# EAGLE design Transistor Tester - Ard MiniPro - v2 (EAGLE 6.5.0)
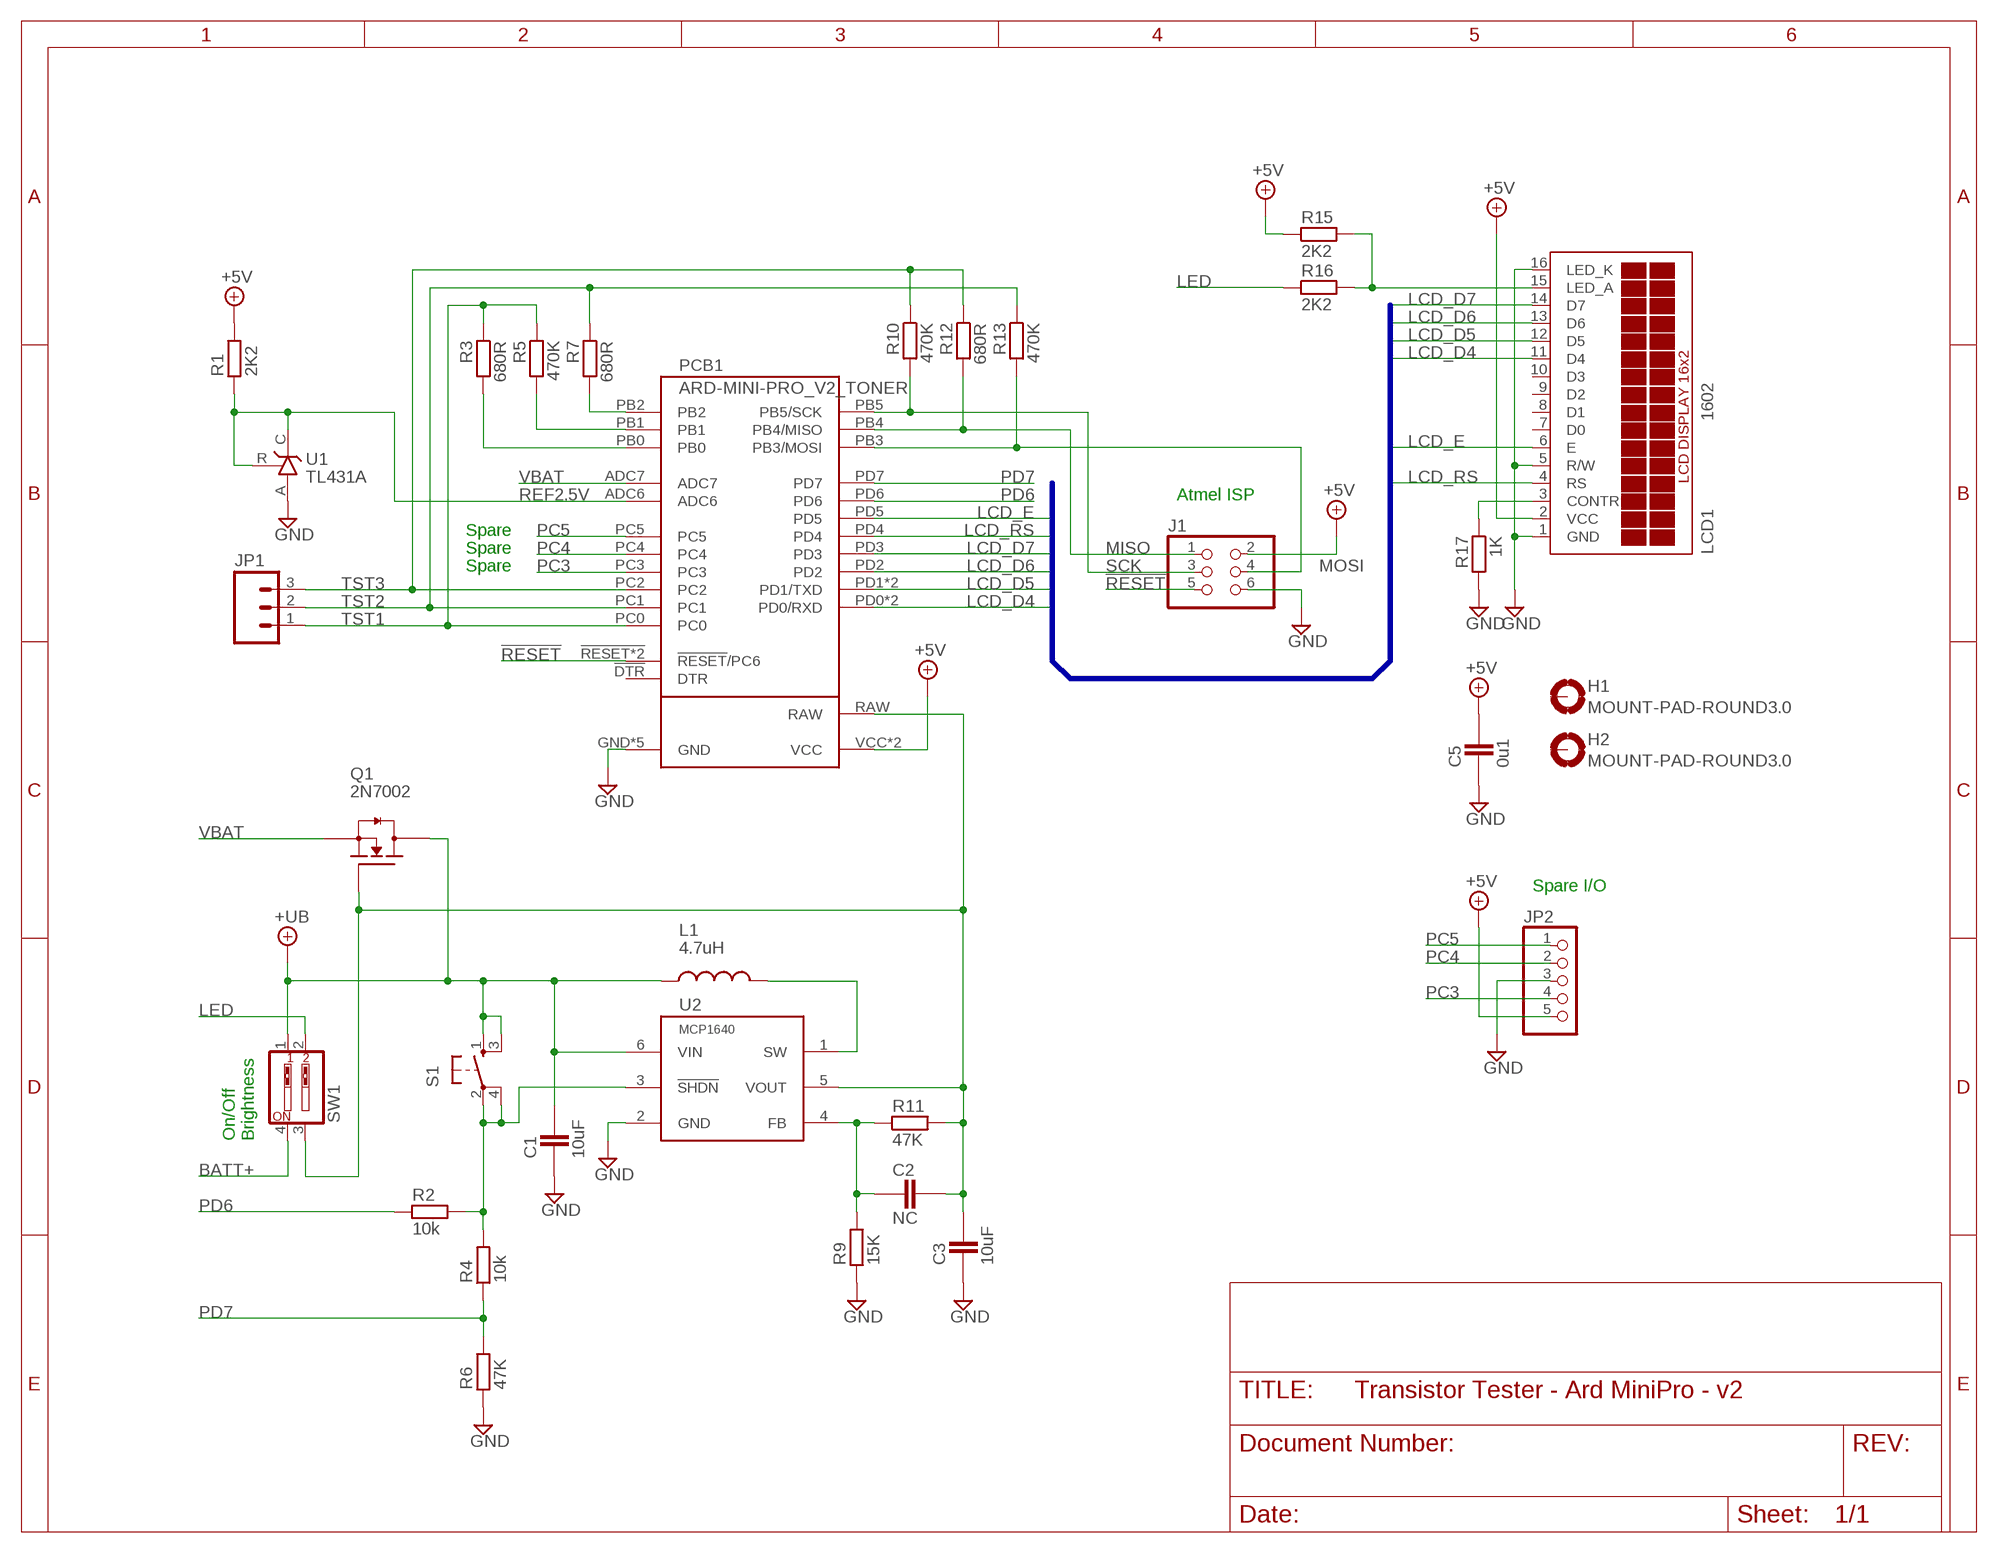
[diagram p0: schematic, sheet 1]

## Parts
C1  10uF  CAPACITOR_0805  [CAPC2012X145AN]
C2  NC  CAPACITOR_0805  [CAPC2012X145AN]
C3  10uF  CAPACITOR_0805  [CAPC2012X145AN]
C5  0u1  CAPACITOR_0603  [CAPC1608X92N]
H1  MOUNT-PAD-ROUND3.0  [3,0-PAD]
H2  MOUNT-PAD-ROUND3.0  [3,0-PAD]
J1  PINHD-2X3_2.54  [2X03]
JP1  M03POLAR  [MOLEX-1X3]
JP2  PINHD-1X5  [1X05]
L1  4.7uH  CD43  [CD43]
LCD1  1602  TUXGR_16X2_R2NOMOUNT  [TUXGR_16X2_R2_NM]
PCB1  ARD-MINI-PRO_V2_TONER  [ARDUINO-PRO-MINI_V2_TONER]
Q1  2N7002  MOSFET-NCH_SOT-23  [SOT95P280X135-3N]
R1  2K2  RESISTOR_0603  [RESC1608X55N]
R2  10k  RESISTOR_0603  [RESC1608X55N]
R3  680R  RESISTOR_0603  [RESC1608X55N]
R4  10k  RESISTOR_0603  [RESC1608X55N]
R5  470K  RESISTOR_0603  [RESC1608X55N]
R6  47K  RESISTOR_0603  [RESC1608X55N]
R7  680R  RESISTOR_0603  [RESC1608X55N]
R9  15K  RESISTOR_0603  [RESC1608X55N]
R10  470K  RESISTOR_0603  [RESC1608X55N]
R11  47K  RESISTOR_0603  [RESC1608X55N]
R12  680R  RESISTOR_0603  [RESC1608X55N]
R13  470K  RESISTOR_0603  [RESC1608X55N]
R15  2K2  RESISTOR_0603  [RESC1608X55N]
R16  2K2  RESISTOR_0603  [RESC1608X55N]
R17  1K  RESISTOR_0603  [RESC1608X55N]
S1  MOM_SWTH  [MOM_SW]
SW1  SW_DIP-2  [EDG-02]
U1  TL431A  TL_431LP  [TO92-CLP]
U2  MCP1640  BOOST-MCP1624T-I/CHY  [SOT26]

## Nets
!RESET: J1.5 PCB1.!RESET(!RESET!/PC6) PCB1.!RESET@3(!RESET!/PC6)
!SHUTDN: R2.2 R4.2 S1.2 S1.4 U2.3(!SHDN)
+5V: C5.2 J1.2 JP2.5 LCD1.2(VCC) PCB1.VCC PCB1.VCC@2(VCC) R1.2 R15.1
+UB: C1.2 L1.1 Q1.3(D) S1.1 S1.3 SW1.1 U2.6(VIN)
BATT+: SW1.4
GND: C1.1 C3.1 C5.1 J1.6 JP2.3 LCD1.1(GND) LCD1.5(R/W) LCD1.16(LED_K) PCB1.GND PCB1.GND@1(GND) PCB1.GND@2(GND) PCB1.GND@3(GND) PCB1.GND@5(GND) R6.1 R9.1 R17.2 U1.A U2.2(GND)
LCD_A: LCD1.15(LED_A) R15.2 R16.2
LCD_D4: LCD1.11(D4) PCB1.PD0(PD0/RXD) PCB1.PD0@2(PD0/RXD)
LCD_D5: LCD1.12(D5) PCB1.PD1(PD1/TXD) PCB1.PD1@2(PD1/TXD)
LCD_D6: LCD1.13(D6) PCB1.PD2
LCD_D7: LCD1.14(D7) PCB1.PD3
LCD_E: LCD1.6(E) PCB1.PD5
LCD_RS: LCD1.4(RS) PCB1.PD4
LED: R16.1 SW1.2
MISO: J1.1 PCB1.PB4(PB4/MISO) R12.2
MOSI: J1.4 PCB1.PB3(PB3/MOSI) R13.2
N$2: L1.2 U2.1(SW)
N$3: C2.2 C3.2 PCB1.RAW Q1.1(G) R11.2 SW1.3 U2.5(VOUT)
N$4: PCB1.PB0 R3.2
N$5: PCB1.PB1 R5.2
N$6: PCB1.PB2 R7.2
N$7: C2.1 R9.2 R11.1 U2.4(FB)
N$27: LCD1.3(CONTR) R17.1
PC3: JP2.4 PCB1.PC3
PC4: JP2.2 PCB1.PC4
PC5: JP2.1 PCB1.PC5
PD6: PCB1.PD6 R2.1
PD7: PCB1.PD7 R4.1 R6.2
REF2.5V: PCB1.ADC6 R1.1 U1.C U1.R
SCK: J1.3 PCB1.PB5(PB5/SCK) R10.2
TST1: JP1.1 PCB1.PC0 R3.1 R5.1
TST2: JP1.2 PCB1.PC1 R7.1 R13.1
TST3: JP1.3 PCB1.PC2 R10.1 R12.1
VBAT: PCB1.ADC7 Q1.2(S)
Unconnected: H1.B3,0(MOUNT) H2.B3,0(MOUNT) LCD1.7(D0) LCD1.8(D1) LCD1.9(D2) LCD1.10(D3) PCB1.!DTR(DTR)

## Buses
B$1

## Notes on the sheet
- Atmel ISP
- Spare
- Spare
- Spare
- Spare I/O
- On/Off
  Brightness

## Library data of the parts
C1-C3 C5 = ipc-7351-capacitor:CAPACITOR_
H1 H2 = holes:MOUNT-PAD-ROUND: MOUNTING PAD, round
J1 = Misc Conn:PINHD-2X3: PIN HEADER
JP1 = SparkFun-Connectors:M03: Header 3 Standard 3-pin 0.1" header. Use with straight break away headers (SKU : PRT-00116), right angle break away headers (PRT-00553), swiss pins (PRT-00743), machine pins (PRT-00117), and female headers (PRT-00115). Molex polarized connector foot print use with SKU : PRT-08232 with associated crimp pins and housings.
JP2 = pinhead:PINHD-1X5: PIN HEADER
L1 = Misc Inductors:CD
LCD1 = Misc opto:TUXGR_16X2_R2: Tuxgraphics LCD display 16x2 characters reflective, without background light Source: tuxgr_12x2_r2.pdf; OC_FARNELL: unknown; OC_NEWARK: unknown
PCB1 = misc pcb:ARD-MINI-PRO
Q1 = ipc-7351-transistor:MOSFET-NCH_
R1-R7 R9-R13 R15-R17 = ipc-7351-resistor:RESISTOR_
S1 = Misc Passives:MOM_SW: Tact Switch
SW1 = special:SW_DIP-2: DIP SWITCH
U1 = Misc Analog:TL_431: Voltage Reference 1.24V TI TL431, ST3431
U2 = Misc Power:BOOST-

## Net classes
1 diff: width 0.003 mm, drill 0.006 mm, clearance 0.007 mm

## Board
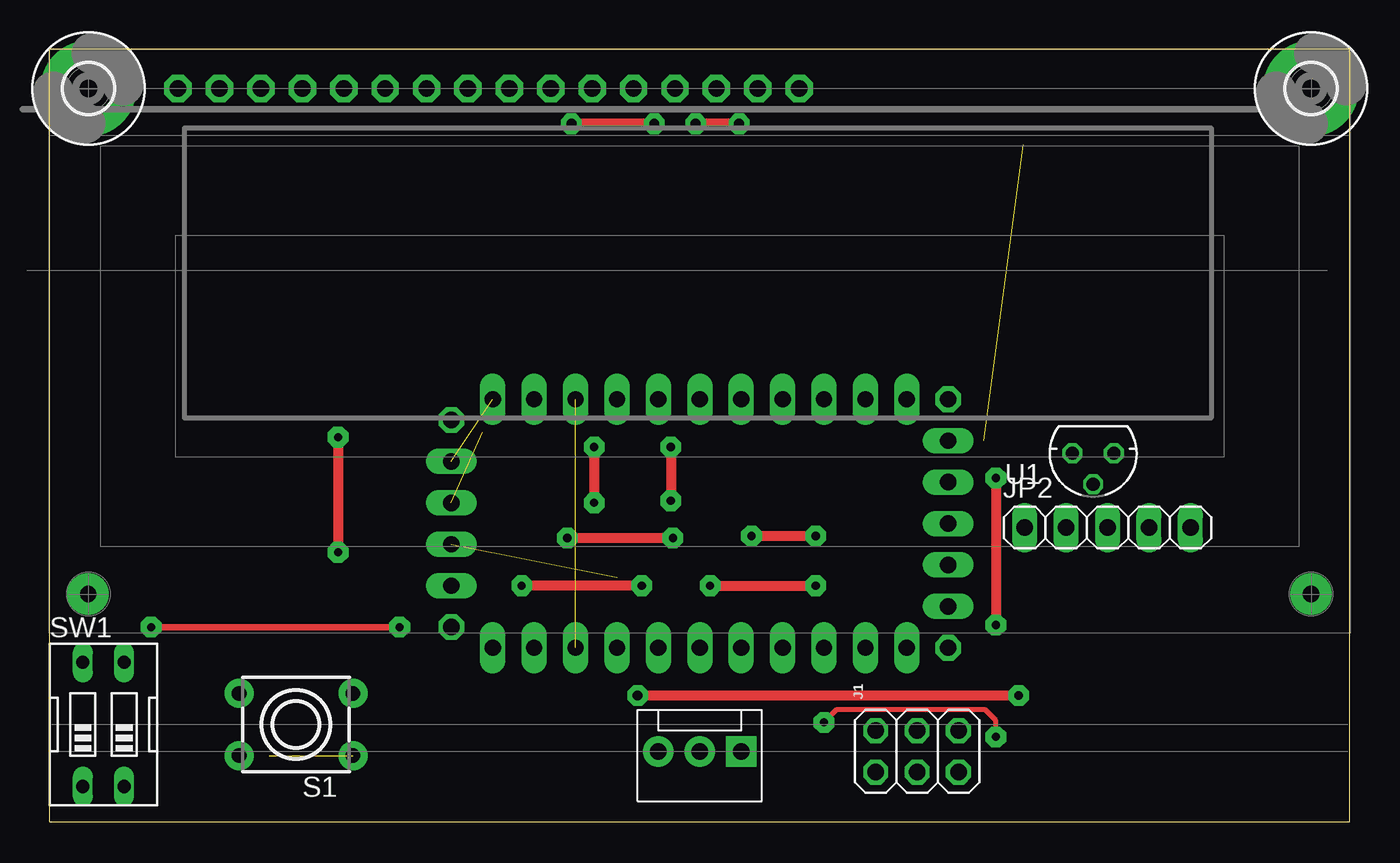
[diagram p1: board, top side]
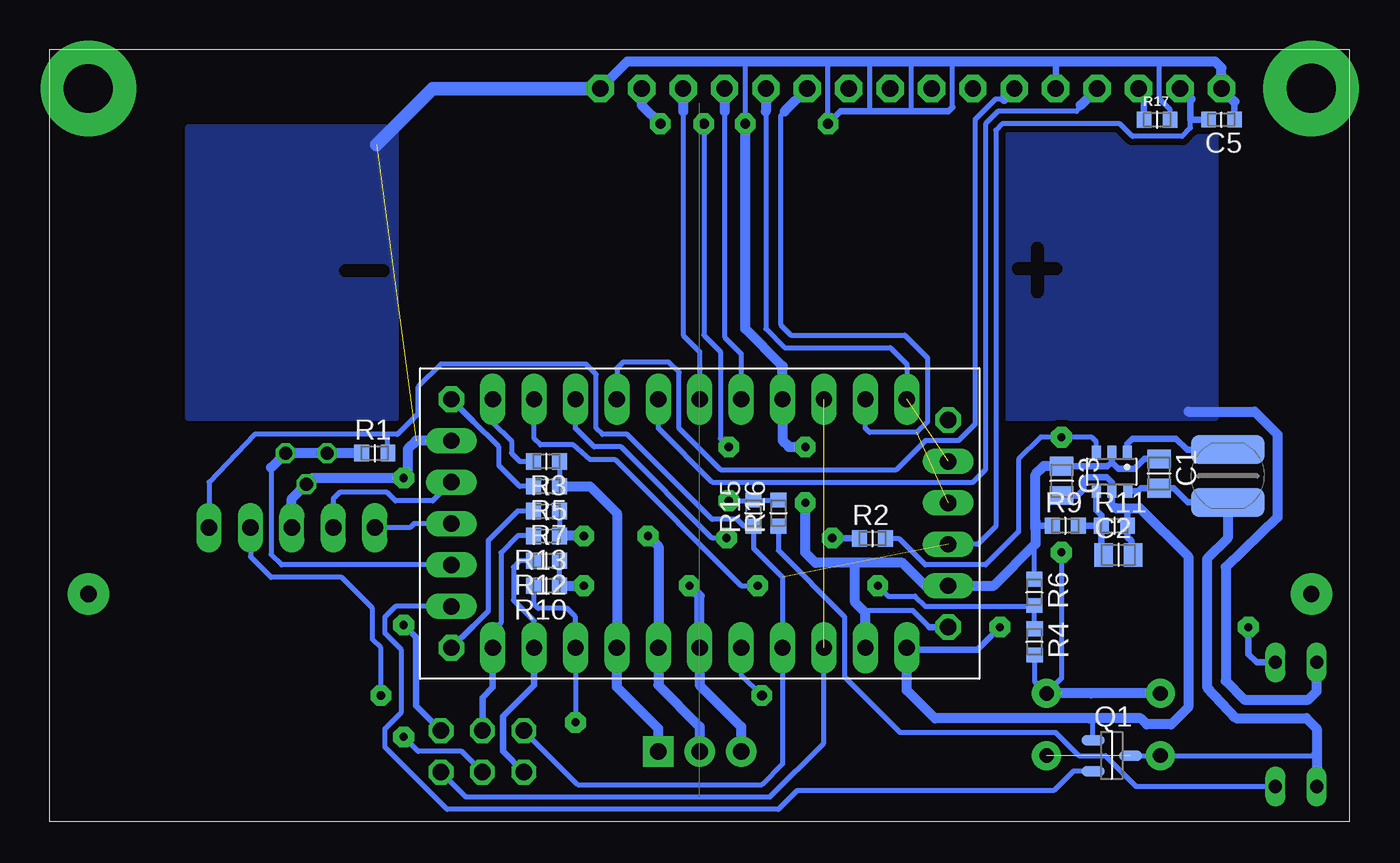
[diagram p2: board, bottom side, seen from below]

Size 79.76 x 47.37 mm. Coordinates in mm from the lower left corner, seen from the top.
Outline: 0,0 79.76,0 79.76,47.37 0,47.37 0,0
Copper layers (1*16): Top 0.035559375mm / dielectric 1.6mm / Bottom 0.035559375mm
Design rules "oshpark-2layer": minimum track width 6mil, minimum drill 10mil, track to track 6mil, track to pad 6mil, pad to pad 6mil, via to via 6mil, smd to smd 6mil, copper to edge 15mil, drill to drill 6mil, minimum pad ring 5mil, minimum via ring 5mil, stop-mask expansion 2.5mil, vias tented up to drill 0mil, thermal gap 10mil
bRestrict: 3 lines

### Footprints (pad centres in the part's own frame; a part is rotated, then mirrored left to right if it is on the bottom)
CAPC2012X145AN = smd 1.15 x 1.45: 1 -0.9,0; 2 0.9,0
CAPC1608X92N = smd 0.9 x 0.95: 1 -0.8,0; 2 0.8,0
3,0-PAD = drill 3 pad 5.842: B3,0 0,0
2X03 = drill 1.016 octagon: 1 -2.54,-1.27; 2 -2.54,1.27; 3 0,-1.27; 4 0,1.27; 5 2.54,-1.27; 6 2.54,1.27
MOLEX-1X3 = drill 1.016 pad 1.88 square: 1 0,0 | drill 1.016 pad 1.88: 2 2.54,0; 3 5.08,0
1X05 = drill 1.016 long: 1 -5.08,0; 2 -2.54,0; 3 0,0; 4 2.54,0; 5 5.08,0
CD43 = smd 4.5 x 1.75: 1 0,1.625; 2 0,-1.625
TUXGR_16X2_R2_NM = drill 1 pad 1.676 octagon: 1 -32,15.5; 2 -29.46,15.5; 3 -26.92,15.5; 4 -24.38,15.5; 5 -21.84,15.5; 6 -19.3,15.5; 7 -16.76,15.5; 8 -14.22,15.5; 9 -11.68,15.5; 10 -9.14,15.5; 11 -6.6,15.5; 12 -4.06,15.5; 13 -1.52,15.5; 14 1.02,15.5; 15 3.56,15.5; 16 6.1,15.5
ARDUINO-PRO-MINI_V2_TONER = drill 1 pad 1.575 octagon: !DTR -15.24,-6.35; GND@1 -15.24,6.35; PB1 15.24,-7.62; PB2 15.24,7.62 | drill 1 pad 1.575 long: !RESET -7.62,-7.62; !RESET@3 -7.62,7.62; ADC6 15.24,2.54; ADC7 15.24,5.08; GND 15.24,-5.08; GND@2 -5.08,-7.62; GND@3 -15.24,3.81; GND@5 -10.16,7.62; PB0 12.7,-7.62; PB3 12.7,7.62; PB4 10.16,7.62; PB5 7.62,7.62; PC0 5.08,7.62; PC1 2.54,7.62; PC2 0,7.62; PC3 -2.54,7.62; PC4 15.24,-2.54; PC5 15.24,0; PD0 -15.24,-1.27; PD0@2 -10.16,-7.62; PD1 -15.24,-3.81; PD1@2 -12.7,-7.62; PD2 -2.54,-7.62; PD3 0,-7.62; PD4 2.54,-7.62; PD5 5.08,-7.62; PD6 7.62,-7.62; PD7 10.16,-7.62; RAW -12.7,7.62; VCC -15.24,1.27; VCC@2 -5.08,7.62
SOT95P280X135-3N = smd 1.4 x 0.65: 1 -1.15,0.95; 2 -1.15,-0.95; 3 1.15,0
RESC1608X55N = smd 0.9 x 1: 1 -0.8,0; 2 0.8,0
MOM_SW = drill 0.9 pad 1.778: 1 -1.905,3.493; 2 1.905,3.493; 3 -1.905,-3.493; 4 1.905,-3.493
EDG-02 = drill 0.813 long: 1 -1.27,-3.81; 2 1.27,-3.81; 3 1.27,3.81; 4 -1.27,3.81
TO92-CLP = drill 0.813 octagon: A 0,1.905; C 1.27,0; R -1.27,0
SOT26 = smd 0.55 x 0.8: 1 -0.95,-1.2; 2 0,-1.2; 3 0.95,-1.2; 4 0.95,1.2; 5 0,1.2; 6 -1,1.2

### Placement (x,y rotation side)
C1  11.71,21.35 270 bottom
C2  14.2,16.37 0 bottom
C3  17.68,20.9 270 bottom
C5  7.87,43.05 180 bottom
H1  2.37,44.97 0 top
H2  77.38,44.97 0 top
J1  53.21,4.32 0 top
JP1  42.42,4.32 180 top
JP2  64.9,18.03 0 top
L1  7.49,21.21 180 bottom
LCD1  39.88,29.46 0 top
PCB1  39.88,18.29 180 bottom
Q1  14.61,4.06 0 bottom
R1  59.82,22.61 0 bottom
R2  29.29,17.37 0 bottom
R3  49.28,22.1 180 bottom
R4  19.34,11.04 270 bottom
R5  49.28,20.57 180 bottom
R6  19.35,14.07 270 bottom
R7  49.28,19.05 180 bottom
R9  17.45,18.15 0 bottom
R10  49.28,14.48 180 bottom
R11  14.44,18.15 0 bottom
R12  49.28,16 180 bottom
R13  49.28,17.53 180 bottom
R15  36.58,18.92 90 bottom
R16  35.05,18.92 90 bottom
R17  11.82,43.05 0 bottom
S1  15.11,5.97 90 top
SW1  3.3,5.97 0 top
U1  64.01,22.61 180 top
U2  14.61,21.46 180 bottom

### Tracks (layer width: path | path; a pad name or v marks a point on that pad's centre or on a via)
!RESET  (1 unrouted)
  Bottom 0.305: J1.5 54.23,1.52 35.56,1.52 32.26,4.83 PCB1.!RESET@3
!SHUTDN  (via drill 0.5 pad 1.27)
  Top 0.61: v17.69,23.58 v17.69,16.52
  Bottom 0.305: U2.3 15.55,23.3 15.84,23.58 v17.69,23.58 18.96,23.58 20.32,22.23 20.32,17.78 22.35,15.75 26.04,15.75 27.66,17.37 R2.2 | 16.04,8.04 15.88,7.87 | R4.2 19.34,8.61 S1.4 17.69,8.79 v17.69,16.52
  Bottom 0.61: S1.2 15.88,7.87 S1.4
+5V  (1 unrouted)
  Bottom 0.305: 59.05,23.75 58.42,23.75 57.15,25.02 57.15,26.67 55.75,28.07 46.86,28.07 46.23,27.43 46.23,24.13 45.85,23.75 44.32,23.75 39.12,18.54 37.59,18.54 37.17,18.12 R15.1 36.58,16.76 34.8,14.99 PCB1.VCC@2 34.8,3.56 36.07,2.29 47.37,2.29 J1.2 | 59.05,23.75 67.18,23.75 69.98,20.83 JP2.5 | R1.2 59.02,23.71 59.05,23.75 | 9.78,43.05 9.78,42.55 10.29,42.04 13.34,42.04 14.1,42.8 21.34,42.8 21.72,42.42 21.72,18.11 22.81,17.02 PCB1.VCC
  Bottom 0.406: 9.78,44.33 9.78,43.05 C5.2
  Bottom 0.61: 9.78,44.33 LCD1.2
+UB  (1 unrouted)
  Bottom 0.305: Q1.3 S1.1 2.16,4.06
  Bottom 0.406: U2.6 13.01,20.26 12.82,20.45 C1.2 10.79,20.45 9.93,19.58 L1.1 | 2.16,4.06 2.03,4.19
  Bottom 0.61: L1.1 7.49,17.4 8.76,16.13 8.76,8.26 6.99,6.35 2.67,6.35 2.03,5.71 2.03,4.19 SW1.1
BATT+
  Bottom 0.61: 9.91,25.15 5.84,25.15 4.45,23.75 4.45,18.67 7.62,15.62 7.62,8.64 6.48,7.49 2.54,7.49 2.03,8 SW1.4
  pour Bottom (isolate 0.406): 8.26,42.55 20.95,42.55 20.95,24.77 8.26,24.77
GND  (via drill 0.5 pad 1.27, 0.6 pad 1.27)  (1 unrouted)
  Top 0.61: v33.4,22.99 v33.4,19.56 | v58.04,21.08 v58.04,12.06 | v37.08,42.8 v32,42.8
  Bottom 0.305: 18.04,46.61 18.16,46.61 | v37.08,42.8 37.08,46.61 | 19.19,17.95 19.28,17.93 | LCD1.1 | R17.2 11.02,43.66 11.68,44.32 11.68,46.48 11.81,46.61 | 24.38,43.81 24.38,46.74 | 26.92,46.61 26.92,43.56 | 29.46,46.61 29.46,43.56 | v32,42.8 32,46.35 32.13,46.48 | R6.1 19.36,16.97 19.28,17.04 | 25.78,11.94 26.8,12.95 29.59,12.95 29.72,12.83
  Bottom 0.406: LCD1.5 18.04,46.61 | C3.1 17.42,21.81 14.86,21.81 14.61,22.06 | C1.1 12.61,22.25 13.21,21.65 14.2,21.65 14.61,22.06 | U2.2 14.61,22.06 | v58.04,12.06 57.28,11.3 57.28,7.11 J1.6 | C5.1 7.07,44.16 | v32,42.8 31.24,43.56 29.46,43.56 26.92,43.56 24.64,43.56 24.38,43.81 | PCB1.GND@1 25.78,11.94 | R9.1 19.28,18.15 19.28,18.41
  Bottom 0.61: LCD1.1 7.88,46.23 8.26,46.61 11.81,46.61 18.16,46.61 26.92,46.61 29.46,46.61 37.08,46.61 44.33,46.61 LCD1.16 | v37.08,42.8 37.08,30.23 34.8,27.94 PCB1.GND@2 34.8,23.37 34.42,22.99 v33.4,22.99 | v33.4,19.56 33.4,16.51 32.77,15.88 30.35,15.88 | PCB1.GND@5 29.72,12.83 30.35,13.46 30.35,15.88 | 30.35,15.88 27.43,15.88 26.04,14.48 PCB1.GND@3 21.84,14.48 19.28,17.04 19.28,17.93 19.28,18.41 19.28,21.3 18.77,21.8 C3.1 | PCB1.GND 57.28,23.37 57.78,22.86 57.78,21.34 v58.04,21.08 63.63,21.08 U1.A 64.9,19.81 JP2.3 | LCD1.1 7.07,44.16
  Bottom 0.813: LCD1.16 56.26,44.96 59.69,41.53
  pour Bottom (isolate 0.406): 58.55,24.77 71.25,24.77 71.25,42.55 58.55,42.55
LCD_A  (via drill 0.5 pad 1.27, 0.6 pad 1.27)
  Top 0.61: v42.29,42.8 v39.62,42.8 | v38.1,22.99 v38.1,19.68
  Bottom 0.305: v39.62,42.8 39.62,29.84 38.61,28.83 38.61,23.5 v38.1,22.99 | v38.1,19.68 36.61,19.68 R15.2 R16.2
  Bottom 0.61: LCD1.15 43.44,43.95 v42.29,42.8
LCD_D4  (1 unrouted)
  Bottom 0.305: PCB1.PD0@2 29.72,24.13 29.46,23.88 26.54,23.88 25.91,24.51 25.91,28.45 27.3,29.84 34.29,29.84 34.92,30.48 34.92,43.31 34.67,43.56 | LCD1.11
  Bottom 0.61: LCD1.11 34.67,43.56
LCD_D5  (1 unrouted)
  Bottom 0.305: PCB1.PD1@2 27.18,28.07 28.19,29.08 34.67,29.08 35.82,30.23 35.81,43.43 35.82,43.56
  Bottom 0.61: LCD1.12 35.82,43.56
LCD_D6
  Bottom 0.305: 38.36,43.56 38.35,43.18 38.36,29.72 37.34,28.7 PCB1.PD2
  Bottom 0.61: LCD1.13 38.36,43.56
LCD_D7
  Bottom 0.305: 40.9,43.56 40.89,43.56 40.9,29.85 39.88,28.83 PCB1.PD3
  Bottom 0.61: LCD1.14 40.9,43.56
LCD_E
  Bottom 0.305: PCB1.PD5 44.96,27.81 44.58,28.19 41.78,28.19 41.15,27.56 41.15,24.13 38.61,21.59 27.81,21.59 26.04,23.37 24,23.37 22.99,24.38 22.99,43.05 21.72,44.32 21.21,44.32 | LCD1.6
  Bottom 0.61: 21.21,44.32 LCD1.6
LCD_RS
  Bottom 0.305: LCD1.4 | 16.51,43.94 16.51,43.81 16.76,43.56 21.59,43.56 22.35,42.8 22.35,21.59 23.11,20.83 39.12,20.83 42.42,24.13 PCB1.PD4
  Bottom 0.61: LCD1.4 16.51,43.94
LED
  Bottom 0.305: R16.1 35.05,16.64 30.99,12.57 30.99,8.89 27.56,5.46 18.03,5.46 16.64,4.06 14.99,4.06 13.08,2.16 SW1.2
MISO
  Bottom 0.305: R12.2 50.93,16 51.31,15.62 51.31,13.59 50.04,12.32 PCB1.PB4
  Bottom 0.406: PCB1.PB4 50.04,8.38 51.94,6.48 51.94,4.32 J1.1
MOSI
  Bottom 0.305: R13.2 51.05,17.53 52.07,16.51 52.07,12.19 52.58,11.68 PCB1.PB3
  Bottom 0.406: PCB1.PB3 52.58,8.26 53.21,7.62 J1.4
N$2
  Bottom 0.406: 7.53,22.8 9.97,22.8 10.67,23.5 13.34,23.5 13.65,23.18 U2.1
  Bottom 0.61: 7.53,22.8 L1.2
N$3  (via drill 0.5 pad 1.27)
  Top 0.406: v6.22,11.94 v21.46,11.94
  Bottom 0.305: Q1.1 15.76,6.34 16,6.34
  Bottom 0.406: C3.2 16.7,20 16.34,20.36 16.34,20.92 16.14,21.12 14.9,21.12 14.61,20.83 U2.5 14.61,19.47 14.38,19.24 | SW1.3 5.71,9.78 6.22,10.29 v6.22,11.94 | v21.46,11.94 22.86,10.54 27.05,10.54 PCB1.RAW | 13.84,19.24 13.64,19.24 R11.2 13.64,17.45 13.41,17.22 C2.2
  Bottom 0.61: PCB1.RAW 27.18,8.06 25.45,6.34 16,6.34 12.83,6.34 12.46,5.97 10.96,5.97 9.92,7.01 9.92,16.27 12.89,19.24 13.84,19.24 14.38,19.24
N$4
  Bottom 0.305: PCB1.PB0 52.58,24.51 51.44,23.37 51.44,22.61 50.93,22.1 R3.2
N$5
  Bottom 0.305: R5.2 50.93,20.57 52.2,21.84 52.2,22.99 53.85,24.64
  Bottom 0.406: 53.85,24.64 PCB1.PB1
N$6
  Bottom 0.305: R7.2 51.05,19.05 52.83,17.27 52.83,12.95 53.85,11.94
  Bottom 0.406: 53.85,11.94 PCB1.PB2
N$7
  Bottom 0.406: R9.2 R11.1 | R11.1 15.24,16.4 C2.1 | R11.1 15.24,18.8 15.55,19.11 U2.4
N$11  (via drill 1 pad 2.54)
  other vias: 2.36,13.98
N$12  (via drill 1 pad 2.54)
  other vias: 77.37,13.96
N$27
  Bottom 0.406: R17.1 12.62,44.63
  Bottom 0.61: 12.62,44.63 LCD1.3
PC3  (via drill 0.5 pad 1.27, 0.6 pad 1.27)
  Top 0.61: v36.07,7.75 v59.44,7.75
  Bottom 0.305: PCB1.PC3 37.34,9.02 v36.07,7.75 | v59.44,7.75 59.44,10.67 59.94,11.18 59.94,13.08 61.85,14.99 66.17,14.99 67.44,16.26 JP2.4
PC4
  Bottom 0.305: PCB1.PC4 56.26,19.68 58.55,19.68 59.05,20.19 61.98,20.19 62.36,19.81 JP2.2
PC5
  Bottom 0.305: PCB1.PC5 57.4,18.29 57.66,18.03 JP2.1
PD6  (via drill 0.5 pad 1.27)
  Top 0.61: v38.23,17.4 v31.75,17.4
  Bottom 0.305: 30.11,17.4 R2.1 | v38.23,17.4 39.12,17.4 44.7,22.99 46.35,22.99 47.5,24.13 PCB1.PD6
  Bottom 0.406: 30.11,17.4 v31.75,17.4
PD7  (via drill 0.5 pad 1.27)
  Top 0.61: v36.32,14.48 v28.96,14.48
  Bottom 0.305: v28.96,14.48 28.33,13.84 26.67,13.84 26.04,13.21 19.48,13.21 R6.2 R4.1 | PCB1.PD7 50.04,23.5 49.66,23.11 47.62,23.11 46.61,22.23 45.09,22.23 37.34,14.48 v36.32,14.48
REF2.5V
  Bottom 0.305: 66.17,21.72 66.17,16.38 65.53,15.75 PCB1.ADC6
  Bottom 0.61: R1.1 U1.C U1.R 66.17,21.72
SCK  (via drill 0.5 pad 1.27)
  Top 0.305: v58.04,5.21 58.04,6.22 57.4,6.86 48.26,6.86 v47.5,6.1
  Bottom 0.305: v47.5,6.1 PCB1.PB5 47.5,12.57 48.01,13.08 49.78,13.08 50.08,13.37 R10.2 | J1.3 54.48,4.32 57.15,4.32 v58.04,5.21
TST1
  Bottom 0.305: R3.1 R5.1
  Bottom 0.61: R5.1 46.61,20.57 44.96,18.92 PCB1.PC0 44.96,8.26 42.42,5.71 JP1.1
TST2  (via drill 0.5 pad 1.27)
  Top 0.61: v43.05,17.53 v46.99,17.53
  Bottom 0.305: R7.1 R13.1
  Bottom 0.61: v46.99,17.53 R13.1 | JP1.2 39.88,5.84 42.42,8.38 PCB1.PC1 42.42,16.89 v43.05,17.53
TST3  (via drill 0.5 pad 1.27)
  Top 0.61: v40.51,14.48 v46.99,14.48
  Bottom 0.305: R10.1 R12.1
  Bottom 0.61: R10.1 v46.99,14.48 | JP1.3 37.34,5.84 39.88,8.38 PCB1.PC2 39.88,13.84 v40.51,14.48
VBAT
  Bottom 0.305: PCB1.ADC7 58.55,13.21 59.18,12.57 59.18,11.56 58.17,10.54 58.17,6.73 59.18,5.71 59.18,4.57 55.37,0.76 35.05,0.76 33.91,1.91 18.16,1.91 16.95,3.11 Q1.2